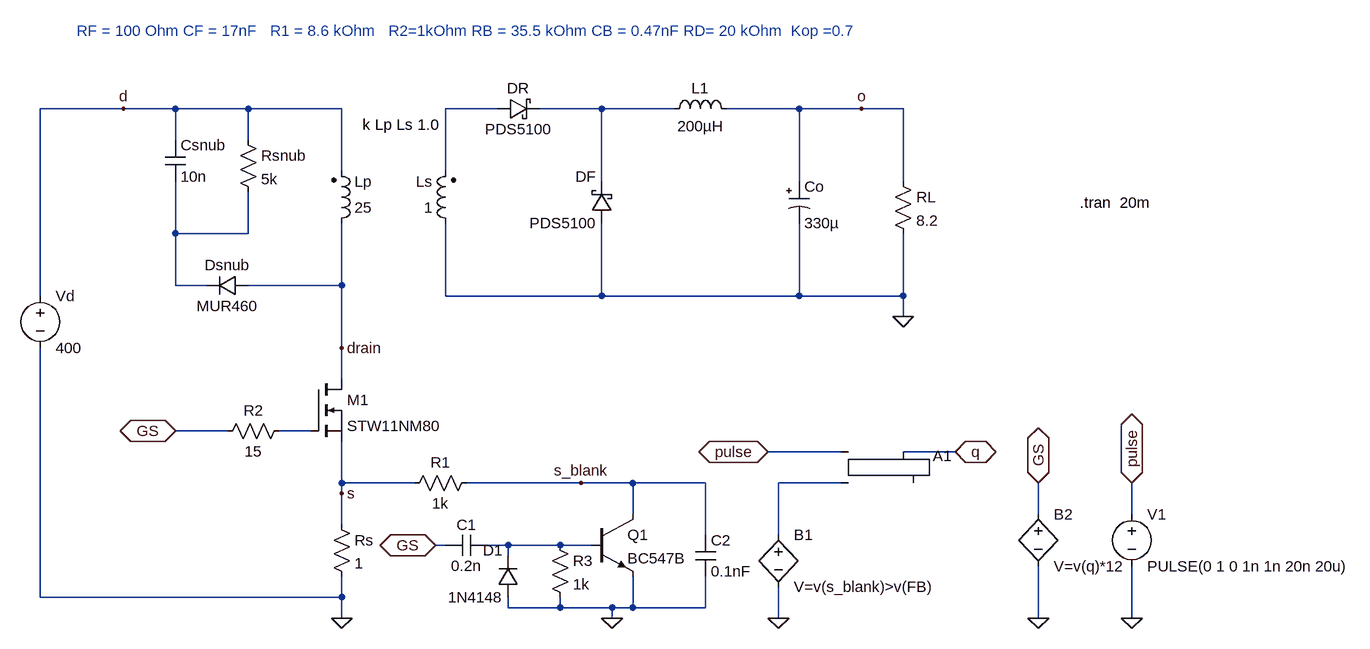
[diagram p0: schematic 5b_current_controller.asc]
5b_current_controller.asc, the LTspice schematic file:
Version 4
SHEET 1 2068 1188
WIRE 144 -144 16 -144
WIRE 224 -144 144 -144
WIRE 336 -144 224 -144
WIRE 480 -144 336 -144
WIRE 720 -144 640 -144
WIRE 880 -144 784 -144
WIRE 992 -144 880 -144
WIRE 1184 -144 1072 -144
WIRE 1280 -144 1184 -144
WIRE 1344 -144 1280 -144
WIRE 224 -96 224 -144
WIRE 336 -96 336 -144
WIRE 480 -48 480 -144
WIRE 640 -48 640 -144
WIRE 880 -32 880 -144
WIRE 1184 -32 1184 -144
WIRE 1344 -32 1344 -144
WIRE 224 48 224 -32
WIRE 336 48 336 -16
WIRE 336 48 224 48
WIRE 224 128 224 48
WIRE 272 128 224 128
WIRE 480 128 480 32
WIRE 480 128 336 128
WIRE 16 144 16 -144
WIRE 640 144 640 32
WIRE 880 144 880 32
WIRE 880 144 640 144
WIRE 1184 144 1184 32
WIRE 1184 144 880 144
WIRE 1344 144 1344 48
WIRE 1344 144 1184 144
WIRE 1344 176 1344 144
WIRE 480 224 480 128
WIRE 480 272 480 224
WIRE 304 352 224 352
WIRE 432 352 384 352
WIRE 1248 384 1136 384
WIRE 1424 384 1344 384
WIRE 480 432 480 368
WIRE 592 432 480 432
WIRE 848 432 672 432
WIRE 928 432 848 432
WIRE 1040 432 928 432
WIRE 1248 432 1152 432
WIRE 480 448 480 432
WIRE 928 480 928 432
WIRE 1552 480 1552 432
WIRE 1696 480 1696 432
WIRE 480 496 480 448
WIRE 1040 512 1040 432
WIRE 1152 512 1152 432
WIRE 640 528 624 528
WIRE 736 528 704 528
WIRE 816 528 736 528
WIRE 864 528 816 528
WIRE 736 544 736 528
WIRE 16 608 16 224
WIRE 480 608 480 576
WIRE 480 608 16 608
WIRE 736 624 736 608
WIRE 816 624 816 608
WIRE 816 624 736 624
WIRE 896 624 816 624
WIRE 928 624 928 576
WIRE 928 624 896 624
WIRE 1040 624 1040 576
WIRE 1040 624 928 624
WIRE 480 640 480 608
WIRE 896 640 896 624
WIRE 1152 640 1152 592
WIRE 1552 640 1552 560
WIRE 1696 640 1696 560
FLAG 1344 176 0
FLAG 480 640 0
FLAG 144 -144 d
FLAG 1280 -144 o
FLAG 480 224 drain
FLAG 480 448 s
FLAG 224 352 GS
IOPIN 224 352 BiDir
FLAG 1696 640 0
FLAG 1696 432 pulse
IOPIN 1696 432 BiDir
FLAG 896 640 0
FLAG 624 528 GS
IOPIN 624 528 BiDir
FLAG 848 432 s_blank
FLAG 1136 384 pulse
IOPIN 1136 384 BiDir
FLAG 1152 640 0
FLAG 1424 384 q
IOPIN 1424 384 BiDir
FLAG 1552 640 0
FLAG 1552 432 GS
IOPIN 1552 432 BiDir
SYMBOL voltage 16 128 R0
WINDOW 123 0 0 Left 0
WINDOW 39 0 0 Left 0
SYMATTR InstName Vd
SYMATTR Value 400
SYMBOL ind2 464 48 M180
WINDOW 0 36 80 Left 0
WINDOW 3 36 40 Left 0
SYMATTR InstName Lp
SYMATTR Value 25
SYMATTR Type ind
SYMBOL ind2 656 48 R180
WINDOW 0 36 80 Left 0
WINDOW 3 36 40 Left 0
SYMATTR InstName Ls
SYMATTR Value 1
SYMATTR Type ind
SYMBOL nmos 432 272 R0
SYMATTR InstName M1
SYMATTR Value STW11NM80
SYMBOL res 320 -112 R0
SYMATTR InstName Rsnub
SYMATTR Value 5k
SYMBOL cap 208 -96 R0
SYMATTR InstName Csnub
SYMATTR Value 10n
SYMBOL diode 336 112 R90
WINDOW 0 0 32 VBottom 0
WINDOW 3 32 32 VTop 0
SYMATTR InstName Dsnub
SYMATTR Value MUR460
SYMBOL schottky 896 32 R180
WINDOW 0 24 72 Left 0
WINDOW 3 24 0 Left 0
SYMATTR InstName DF
SYMATTR Value PDS5100
SYMATTR Description Diode
SYMATTR Type diode
SYMBOL schottky 720 -128 R270
WINDOW 0 32 32 VTop 0
WINDOW 3 0 32 VBottom 0
SYMATTR InstName DR
SYMATTR Value PDS5100
SYMATTR Description Diode
SYMATTR Type diode
SYMBOL ind 976 -128 R270
WINDOW 0 32 56 VTop 0
WINDOW 3 5 56 VBottom 0
SYMATTR InstName L1
SYMATTR Value 200µH
SYMBOL polcap 1168 -32 R0
WINDOW 3 24 64 Left 0
SYMATTR Value 330µ
SYMATTR InstName Co
SYMATTR Description Capacitor
SYMATTR Type cap
SYMATTR SpiceLine V=50 Irms=1.255 Rser=0.054 Lser=0 mfg="United Chemi-Con" pn="LXF50VB331M10X30LL" type="Al electrolytic"
SYMBOL res 1328 -48 R0
SYMATTR InstName RL
SYMATTR Value 8.2
SYMBOL res 464 480 R0
SYMATTR InstName Rs
SYMATTR Value 1
SYMBOL res 400 336 R90
WINDOW 0 0 56 VBottom 0
WINDOW 3 32 56 VTop 0
SYMATTR InstName R2
SYMATTR Value 15
SYMBOL voltage 1696 464 R0
WINDOW 123 0 0 Left 0
WINDOW 39 0 0 Left 0
SYMATTR InstName V1
SYMATTR Value PULSE(0 1 0 1n 1n 20n 20u)
SYMBOL npn 864 480 R0
SYMATTR InstName Q1
SYMATTR Value BC547B
SYMBOL res 688 416 R90
WINDOW 0 0 56 VBottom 0
WINDOW 3 32 56 VTop 0
SYMATTR InstName R1
SYMATTR Value 1k
SYMBOL cap 704 512 R90
WINDOW 0 0 32 VBottom 0
WINDOW 3 32 32 VTop 0
SYMATTR InstName C1
SYMATTR Value 0.2n
SYMATTR SpiceLine Rser=100
SYMBOL res 800 512 R0
SYMATTR InstName R3
SYMATTR Value 1k
SYMBOL diode 752 608 R180
WINDOW 0 24 72 Left 0
WINDOW 3 24 0 Left 0
SYMATTR InstName D1
SYMATTR Value 1N4148
SYMBOL Digital\\srflop 1296 336 R0
SYMATTR InstName A1
SYMBOL bv 1152 496 R0
SYMATTR InstName B1
SYMATTR Value V=v(s_blank)>v(FB)
SYMBOL bv 1552 464 R0
SYMATTR InstName B2
SYMATTR Value V=v(q)*12
SYMBOL cap 1024 512 R0
SYMATTR InstName C2
SYMATTR Value 0.1nF
SYMATTR SpiceLine Rser=1
TEXT 512 -120 Left 0 !k Lp Ls 1.0
TEXT 1616 0 Left 0 !.tran  20m
TEXT 72 -264 Left 0 ;RF = 100 Ohm CF = 17nF   R1 = 8.6 kOhm   R2=1kOhm RB = 35.5 kOhm CB = 0.47nF RD= 20 kOhm  Kop =0.7

The netlist it stands for:
* 5b_current_controller.asc
Vd d 0 400
Lp drain d 25
Ls 0 N001 1
M1 drain N004 s s STW11NM80
Rsnub d N003 5k
Csnub d N003 10n
Dsnub drain N003 MUR460
DF 0 N002 PDS5100
DR N001 N002 PDS5100
L1 N002 o 200µH
Co o 0 330µ V=50 Irms=1.255 Rser=0.054 Lser=0 mfg="United Chemi-Con" pn="LXF50VB331M10X30LL" type="Al electrolytic"
RL o 0 8.2
Rs s 0 1
R2 N004 GS 15
V1 pulse 0 PULSE(0 1 0 1n 1n 20n 20u)
Q1 s_blank N006 0 0 BC547B
R1 s_blank s 1k
C1 N006 GS 0.2n Rser=100
R3 N006 0 1k
D1 0 N006 1N4148
A1 pulse N005 0 0 0 0 q 0 SRFLOP
B1 N005 0 V=v(s_blank)>v(FB)
B2 GS 0 V=v(q)*12
C2 s_blank 0 0.1nF Rser=1
.model D D
.lib standard.dio
.model NPN NPN
.model PNP PNP
.lib standard.bjt
.model NMOS NMOS
.model PMOS PMOS
.lib standard.mos
k Lp Ls 1.0
.tran  20m
* RF = 100 Ohm CF = 17nF   R1 = 8.6 kOhm   R2=1kOhm RB = 35.5 kOhm CB = 0.47nF RD= 20 kOhm  Kop =0.7
.backanno
.end